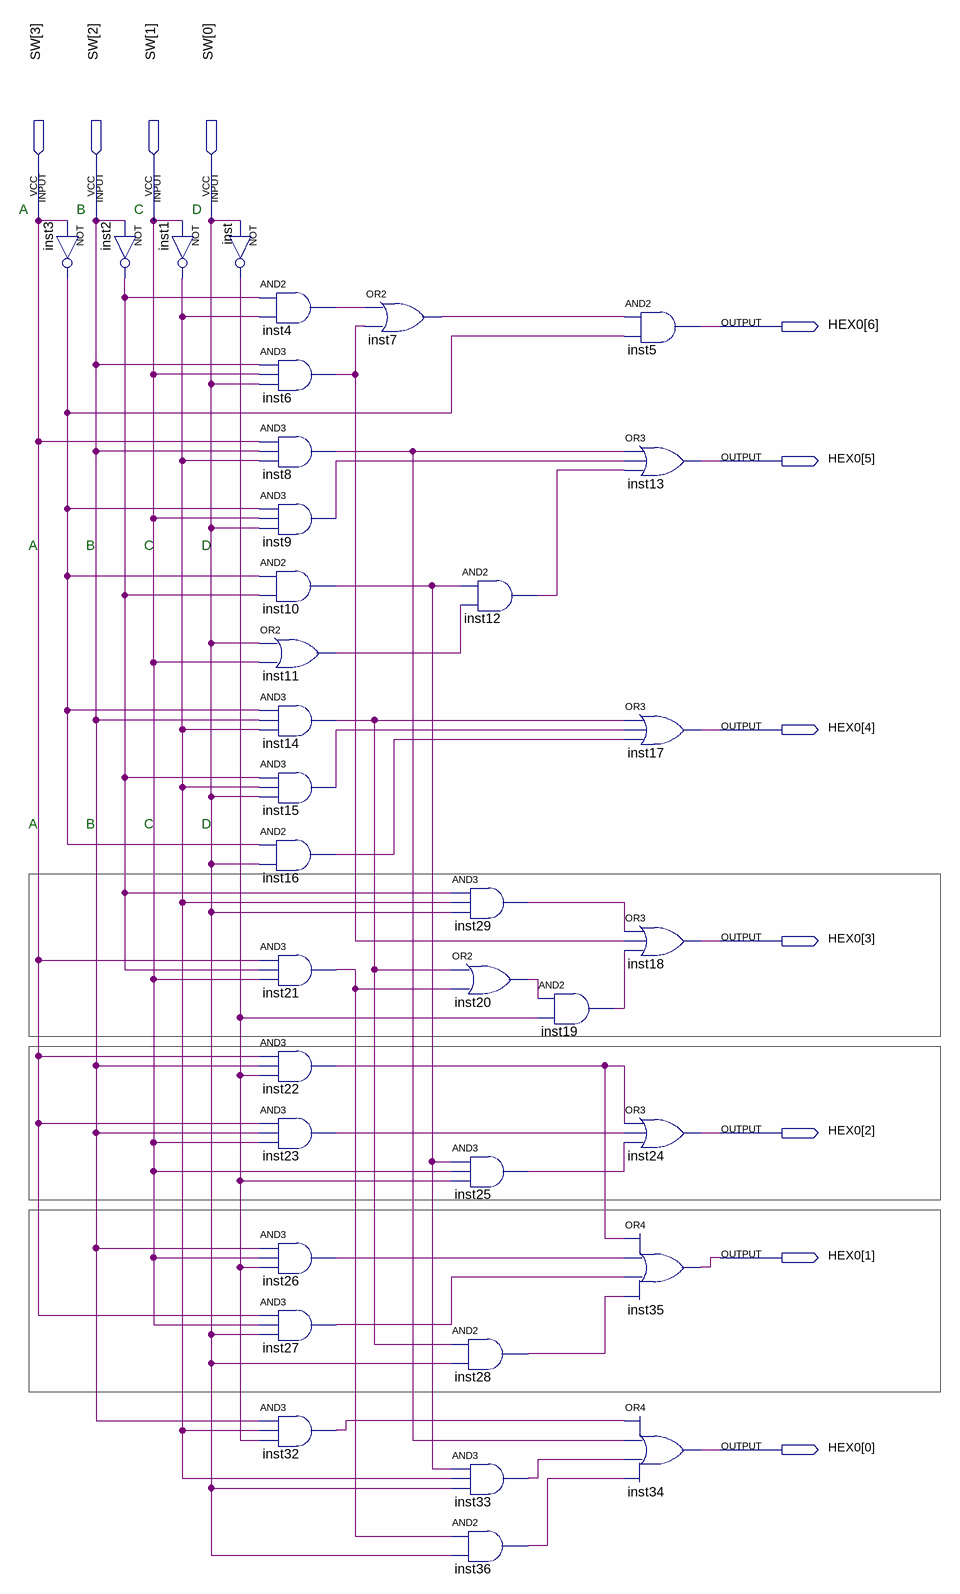
[diagram p0: schematic sheet]
// Quartus schematic SevenSegmentDecoderFull.bdf as structural Verilog: 35 symbols, 11 pins
module SevenSegmentDecoderFull (
  input  [3:0] SW,
  output [6:0] HEX0
);

  wire inst1_out, inst2_out, inst3_out, inst4_out, inst6_out, inst7_out, inst8_out, inst9_out, inst10_out,
       inst11_out, inst12_out, inst14_out, inst15_out, inst16_out, inst19_out, inst20_out, inst21_out,
       inst22_out, inst23_out, inst25_out, inst26_out, inst27_out, inst28_out, inst29_out, inst32_out,
       inst33_out, inst36_out, inst_out;

  not inst3 (inst3_out, SW[3]);
  not inst1 (inst1_out, SW[1]);
  not inst2 (inst2_out, SW[2]);
  not inst (inst_out, SW[0]);
  and inst4 (inst4_out, inst2_out, inst1_out);
  and inst6 (inst6_out, SW[2], SW[1], SW[0]);
  and inst8 (inst8_out, SW[3], SW[2], inst1_out);
  and inst9 (inst9_out, inst3_out, SW[1], SW[0]);
  and inst10 (inst10_out, inst3_out, inst2_out);
  or inst11 (inst11_out, SW[0], SW[1]);
  and inst14 (inst14_out, inst3_out, SW[2], inst1_out);
  and inst15 (inst15_out, inst2_out, inst1_out, SW[0]);
  and inst16 (inst16_out, inst3_out, SW[0]);
  and inst21 (inst21_out, SW[3], inst2_out, SW[1]);
  and inst22 (inst22_out, SW[3], SW[2], inst_out);
  and inst23 (inst23_out, SW[3], SW[2], SW[1]);
  and inst26 (inst26_out, SW[2], SW[1], inst_out);
  and inst27 (inst27_out, SW[3], SW[1], SW[0]);
  and inst32 (inst32_out, SW[2], inst1_out, inst_out);
  or inst7 (inst7_out, inst4_out, inst6_out);
  and inst12 (inst12_out, inst10_out, inst11_out);
  and inst29 (inst29_out, inst2_out, inst1_out, SW[0]);
  or inst20 (inst20_out, inst14_out, inst21_out);
  and inst25 (inst25_out, inst10_out, SW[1], inst_out);
  and inst28 (inst28_out, inst14_out, SW[0]);
  and inst33 (inst33_out, inst10_out, inst1_out, SW[0]);
  and inst36 (inst36_out, inst21_out, SW[0]);
  and inst19 (inst19_out, inst20_out, inst_out);
  and inst5 (HEX0[6], inst7_out, inst3_out);
  or inst13 (HEX0[5], inst8_out, inst9_out, inst12_out);
  or inst17 (HEX0[4], inst14_out, inst15_out, inst16_out);
  or inst18 (HEX0[3], inst29_out, inst6_out, inst19_out);
  or inst24 (HEX0[2], inst22_out, inst23_out, inst25_out);
  or inst35 (HEX0[1], inst22_out, inst26_out, inst27_out, inst28_out);
  or inst34 (HEX0[0], inst32_out, inst8_out, inst33_out, inst36_out);

  // Notes on the sheet:
  //   A
  //   B
  //   C
  //   D
  //   A
  //   B
  //   C
  //   D
  //   A
  //   B
  //   C
  //   D
endmodule
